# EAGLE design armedbase (EAGLE 6.4)
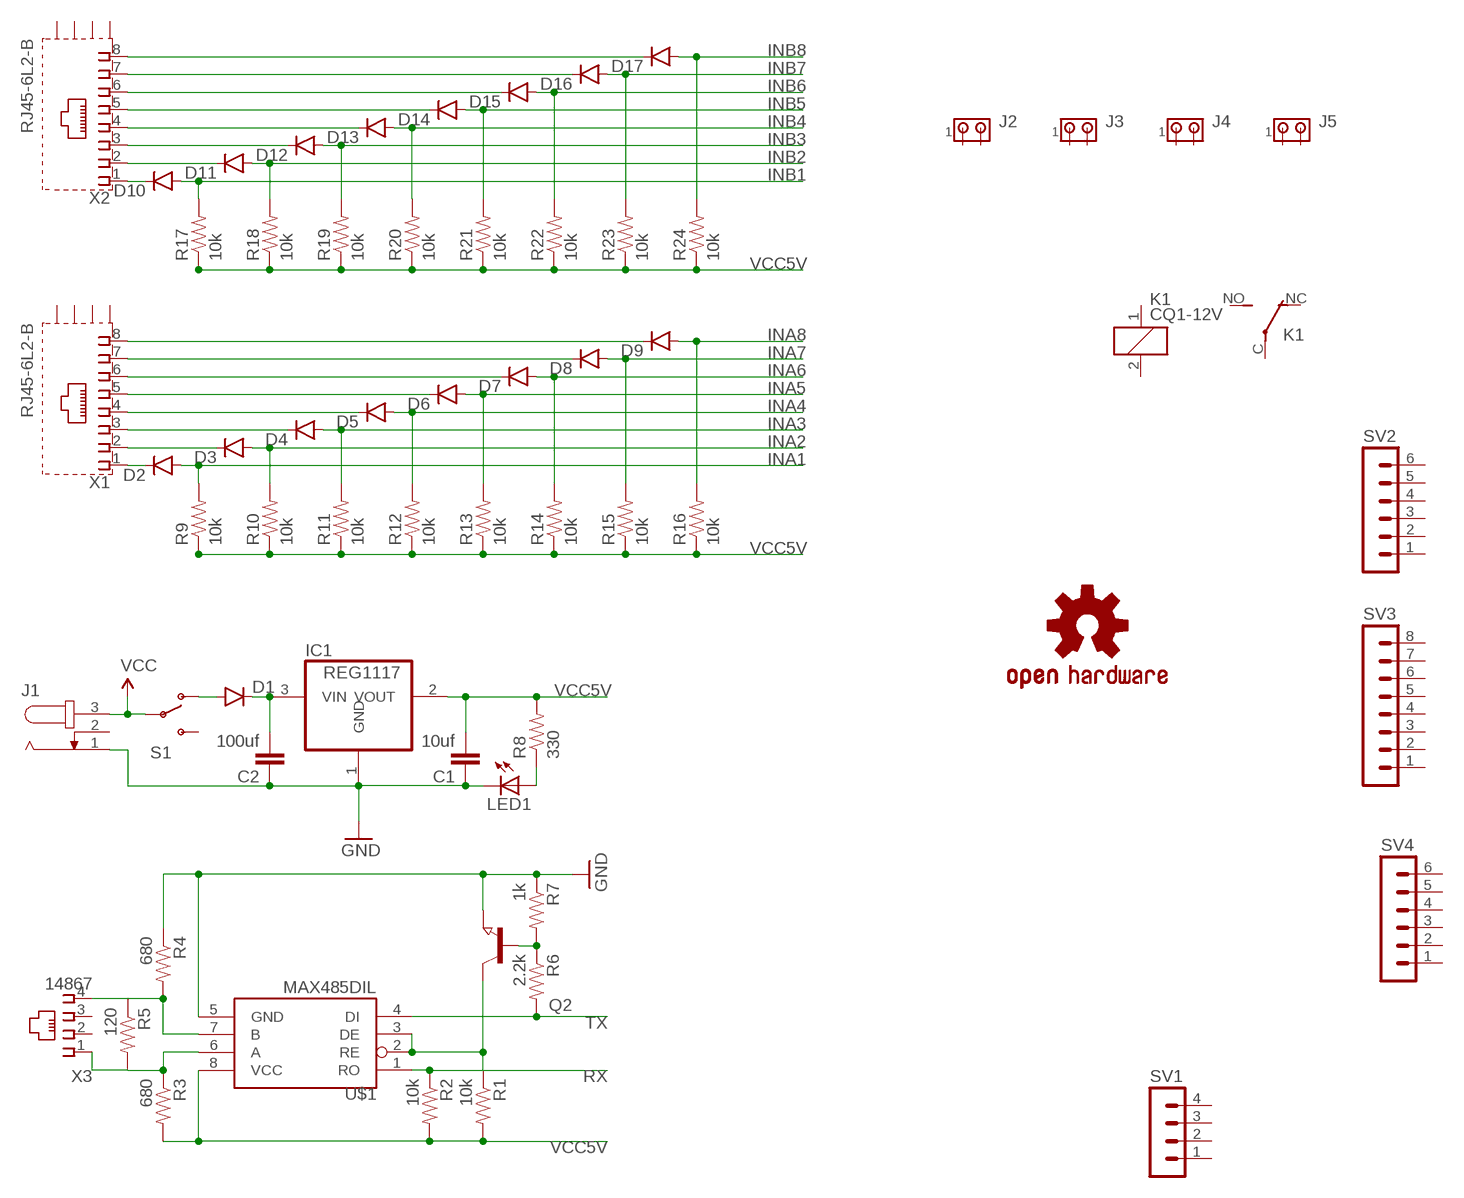
[diagram p0: schematic, sheet 1]

## Parts
C1  10uf  CAP0805  [0805]
C2  100uf  CAP0805  [0805]
D1  DIODESMA  [SMA-DIODE]
D2  DIODESMA  [SMA-DIODE]
D3  DIODESMA  [SMA-DIODE]
D4  DIODESMA  [SMA-DIODE]
D5  DIODESMA  [SMA-DIODE]
D6  DIODESMA  [SMA-DIODE]
D7  DIODESMA  [SMA-DIODE]
D8  DIODESMA  [SMA-DIODE]
D9  DIODESMA  [SMA-DIODE]
D10  DIODESMA  [SMA-DIODE]
D11  DIODESMA  [SMA-DIODE]
D12  DIODESMA  [SMA-DIODE]
D13  DIODESMA  [SMA-DIODE]
D14  DIODESMA  [SMA-DIODE]
D15  DIODESMA  [SMA-DIODE]
D16  DIODESMA  [SMA-DIODE]
D17  DIODESMA  [SMA-DIODE]
IC1  REG1117  [SOT223]
J1  JACK-PLUG1  [SPC4078]
J2  MTA02-156  [1X2MTA]
J3  MTA02-156  [1X2MTA]
J4  MTA02-156  [1X2MTA]
J5  MTA02-156  [1X2MTA]
K1  CQ1-12V  [CQ1]
LED1  LEDCHIP-LED0805  [CHIP-LED0805]
LOGO2  OSHW-LOGOL  [OSHW-LOGO-L]
Q2  NPN-TRANSISTOR_SOT23  [SOT23]
R1  10k  RESISTOR0805-RES  [0805]
R2  10k  RESISTOR0805-RES  [0805]
R3  680  RESISTOR0805-RES  [0805]
R4  680  RESISTOR0805-RES  [0805]
R5  120  RESISTOR0805-RES  [0805]
R6  2.2k  RESISTOR0805-RES  [0805]
R7  1k  RESISTOR0805-RES  [0805]
R8  330  RESISTOR0805-RES  [0805]
R9  10k  RESISTOR0805-RES  [0805]
R10  10k  RESISTOR0805-RES  [0805]
R11  10k  RESISTOR0805-RES  [0805]
R12  10k  RESISTOR0805-RES  [0805]
R13  10k  RESISTOR0805-RES  [0805]
R14  10k  RESISTOR0805-RES  [0805]
R15  10k  RESISTOR0805-RES  [0805]
R16  10k  RESISTOR0805-RES  [0805]
R17  10k  RESISTOR0805-RES  [0805]
R18  10k  RESISTOR0805-RES  [0805]
R19  10k  RESISTOR0805-RES  [0805]
R20  10k  RESISTOR0805-RES  [0805]
R21  10k  RESISTOR0805-RES  [0805]
R22  10k  RESISTOR0805-RES  [0805]
R23  10k  RESISTOR0805-RES  [0805]
R24  10k  RESISTOR0805-RES  [0805]
S1  SWITCH-SPDTSMD2  [SWITCH-SPDT-SMD]
SV1  MA04-1  [MA04-1]
SV2  MA06-1  [MA06-1]
SV3  MA08-1  [MA08-1]
SV4  MA06-1  [MA06-1]
U$1  MAX485DIL  [DIL08]
X1  RJ45-6L2-B  [RJ45-SHIELD2]
X2  RJ45-6L2-B  [RJ45-SHIELD2]
X3  14867  [14867]

## Nets
GND: C1.1 C2.1 IC1.1(GND) J1.1 LED1.C Q2.2(E) R4.1 R7.1 U$1.5(GND)
INA1: D2.A R9.2
INA2: D3.A R10.2
INA3: D4.A R11.2
INA4: D5.A R12.2
INA5: D6.A R13.2
INA6: D7.A R14.2
INA7: D8.A R15.2
INA8: D9.A R16.2
INB1: D10.A R17.2
INB2: D11.A R18.2
INB3: D12.A R19.2
INB4: D13.A R20.2
INB5: D14.A R21.2
INB6: D15.A R22.2
INB7: D16.A R23.2
INB8: D17.A R24.2
N$1: D2.C X1.1
N$2: Q2.3(C) R1.1 U$1.2(RE) U$1.3(DE)
N$3: D10.C X2.1
N$4: Q2.1(B) R6.1 R7.2
N$6: D11.C X2.2
N$7: R4.2 R5.1 U$1.7(B) X3.4
N$8: R3.1 R5.2 U$1.6(A) X3.1
N$9: D12.C X2.3
N$10: D13.C X2.4
N$11: LED1.A R8.1
N$12: D14.C X2.5
N$13: D1.A S1.1(O)
N$14: C2.2 D1.C IC1.3(VIN)
N$15: D15.C X2.6
N$16: D16.C X2.7
N$17: D17.C X2.8
N$25: D3.C X1.2
N$26: D4.C X1.3
N$27: D5.C X1.4
N$28: D6.C X1.5
N$29: D7.C X1.6
N$30: D8.C X1.7
N$31: D9.C X1.8
RX: R2.1 U$1.1(RO)
TX: R6.2 U$1.4(DI)
VCC: J1.3 S1.2(P)
VCC5V: C1.2 IC1.2(VOUT) R1.2 R2.2 R3.2 R8.2 R9.1 R10.1 R11.1 R12.1 R13.1 R14.1 R15.1 R16.1 R17.1 R18.1 R19.1 R20.1 R21.1 R22.1 R23.1 R24.1 U$1.8(VCC)
Unconnected: J1.2 J2.1 J2.2 J3.1 J3.2 J4.1 J4.2 J5.1 J5.2 K1.1 K1.2 K1.C(2:P) K1.NC(2:O) K1.NO(2:S) S1.3(S) SV1.1 SV1.2 SV1.3 SV1.4 SV2.1 SV2.2 SV2.3 SV2.4 SV2.5 SV2.6 SV3.1 SV3.2 SV3.3 SV3.4 SV3.5 SV3.6 SV3.7 SV3.8 SV4.1 SV4.2 SV4.3 SV4.4 SV4.5 SV4.6 X1.S1(S) X1.S2(S) X1.S3(S) X1.S4(S) X2.S1(S) X2.S2(S) X2.S3(S) X2.S4(S) X3.2 X3.3

## Library data of the parts
C1 C2 = SparkFun-Capacitors:CAP: Capacitor Standard 0603 ceramic capacitor, and 0.1" leaded capacitor.
D1-D17 = SparkFun-DiscreteSemi:DIODE: Diode These are standard reverse protection diodes and small signal diodes. SMA package can handle up to about 1A. SOD-323 can handle about 200mA. What the SOD-323 package when ordering, there are some mfgs out there that are 5-pin packages.
IC1 = burr-brown:REG1117: 800mA and 1A Low Dropout (LDO) Positive Regulator 1.8V, 2.5V, 2.85V, 3.3V, 5V, and Adj; MPN: REG1117; OC_FARNELL: 1097566; OC_NEWARK: 14P6981
J1 = con-jack:JACK-PLUG: DC POWER JACK Power Jack, DC, Right Angle, Through Hole, Rated 5A at 16VDC, PC Terminals Distributor: Farnell (www.Farnell.de) Drawing: 84N1161.pdf / 84N1162.pdf Manufacturer: SPC Technology (www.spctechnology.com) Type: SPC4077 / SPC 4078; OC_FARNELL: unknown; OC_NEWARK: unknown
J2-J5 = con-amp:MTA02-156: AMP connector
K1 = relay:CQ1-12V: AUTOMOTIVE QUIET RELAY NAiS Source: http://www.mew-europe.com/.. en_ds_61208_0000.pdf; OC_FARNELL: unknown; OC_NEWARK: unknown
LED1 = led:LED: LED OSRAM: - CHIPLED LG R971, LG N971, LY N971, LG Q971, LY Q971, LO R971, LY R971 LH N974, LH R974 LS Q976, LO Q976, LY Q976 LO Q996 - Hyper CHIPLED LW Q18S LB Q993, LB Q99A, LB R99A - SideLED LS A670, LO A670, LY A670, LG A670, LP A670 LB A673, LV A673, LT A673, LW A673 LH A674 LY A675 LS A676, LA A676, LO A676, LY A676, LW A676 LS A679, LY A679, LG A679 - Hyper Micro SIDELED® LS Y876, LA Y876, LO Y876, LY Y876 LT Y87S - SmartLED LW L88C, LW L88S LB L89C, LB L89S, LG L890 LS L89K, LO L89K, LY L89K LS L896, LA L896, LO L896, LY L896 - TOPLED LS T670, LO T670, LY T670, LG T670, LP T670 LSG T670, LSP T670, LSY T670, LOP T670, LYG T670 LG T671, LOG T671, LSG T671 LB T673, LV T673, LT T673, LW T673 LH T674 LS T676, LA T676, LO T676, LY T676, LB T676, LH T676, LSB T676, LW T676 LB T67C, LV T67C, LT T67C, LS T67K, LO T67K, LY T67K, LW E67C LS E67B, LA E67B, LO E67B, LY E67B, LB E67C, LV E67C, LT E67C LW T67C LS T679, LY T679, LG T679 LS T770, LO T770, LY T770, LG T770, LP T770 LB T773, LV T773, LT T773, LW T773 LH T774 LS E675, LA E675, LY E675, LS T675 LS T776, LA T776, LO T776, LY T776, LB T776 LHGB T686 LT T68C, LB T68C - Hyper Mini TOPLED® LB M676 - Mini TOPLED Santana® LG M470 LS M47K, LO M47K, LY M47K Source: http://www.osram.convergy.de LUXEON: - LUMILED® LXK2-PW12-R00, LXK2-PW12-S00, LXK2-PW14-U00, LXK2-PW14-V00 LXK2-PM12-R00, LXK2-PM12-S00, LXK2-PM14-U00 LXK2-PE12-Q00, LXK2-PE12-R00, LXK2-PE12-S00, LXK2-PE14-T00, LXK2-PE14-U00 LXK2-PB12-K00, LXK2-PB12-L00, LXK2-PB12-M00, LXK2-PB14-N00, LXK2-PB14-P00, LXK2-PB14-Q00 LXK2-PR12-L00, LXK2-PR12-M00, LXK2-PR14-Q00, LXK2-PR14-R00 LXK2-PD12-Q00, LXK2-PD12-R00, LXK2-PD12-S00 LXK2-PH12-R00, LXK2-PH12-S00 LXK2-PL12-P00, LXK2-PL12-Q00, LXK2-PL12-R00 Source: www.luxeon.com KINGBRIGHT: KA-3528ASYC Source: www.kingbright.com
LOGO2 = SparkFun-Aesthetics:OSHW-LOGO: Open Source Hardware Logo This logo indicates the piece of hardware it is found on incorporates a OSHW license and/or adheres to the definition of open source hardware found here: http://freedomdefined.org/OSHW
Q2 = semicon-smd-ipc:NPN-TRANSISTOR_: NPN TRANSISTOR
R1-R24 = SparkFun-Passives:RESISTOR: Resistor Basic schematic elements and footprints for 0603, 1206, and PTH resistors.
S1 = SparkFun-Electromechanical:SWITCH-SPDT: SPDT Switch Simple slide switch, Spark Fun Electronics SKU : COM-00102 DPDT SMT slide switch, AYZ0202, SWCH-08179
SV1 = con-lstb:MA04-1: PIN HEADER; OC_FARNELL: unknown; OC_NEWARK: unknown
SV2 SV4 = con-lstb:MA06-1: PIN HEADER; OC_FARNELL: unknown; OC_NEWARK: unknown
SV3 = con-lstb:MA08-1: PIN HEADER; OC_FARNELL: unknown; OC_NEWARK: unknown
U$1 = SparkFun-DigitalIC:MAX485: RS-485 transceiver
X1 X2 = con-tycoelectronics:RJ45*2: RJ45 Low Profile Shield Type 2 For all RJ45 L, LC, LCT and X Series Models Source: www.tycoelectronics.com .. ENG_DS_1654001_1099_RJ_L_0507.pdf; MPN: RJ45-6L2-B; OC_FARNELL: unknown; OC_NEWARK: 16R6096
X3 = con-4ucon:14867: RJ11 Connector Source: 4UCON TECHNOLOGY INC. 14867.pdf; OC_FARNELL: unknown; OC_NEWARK: unknown

## Board
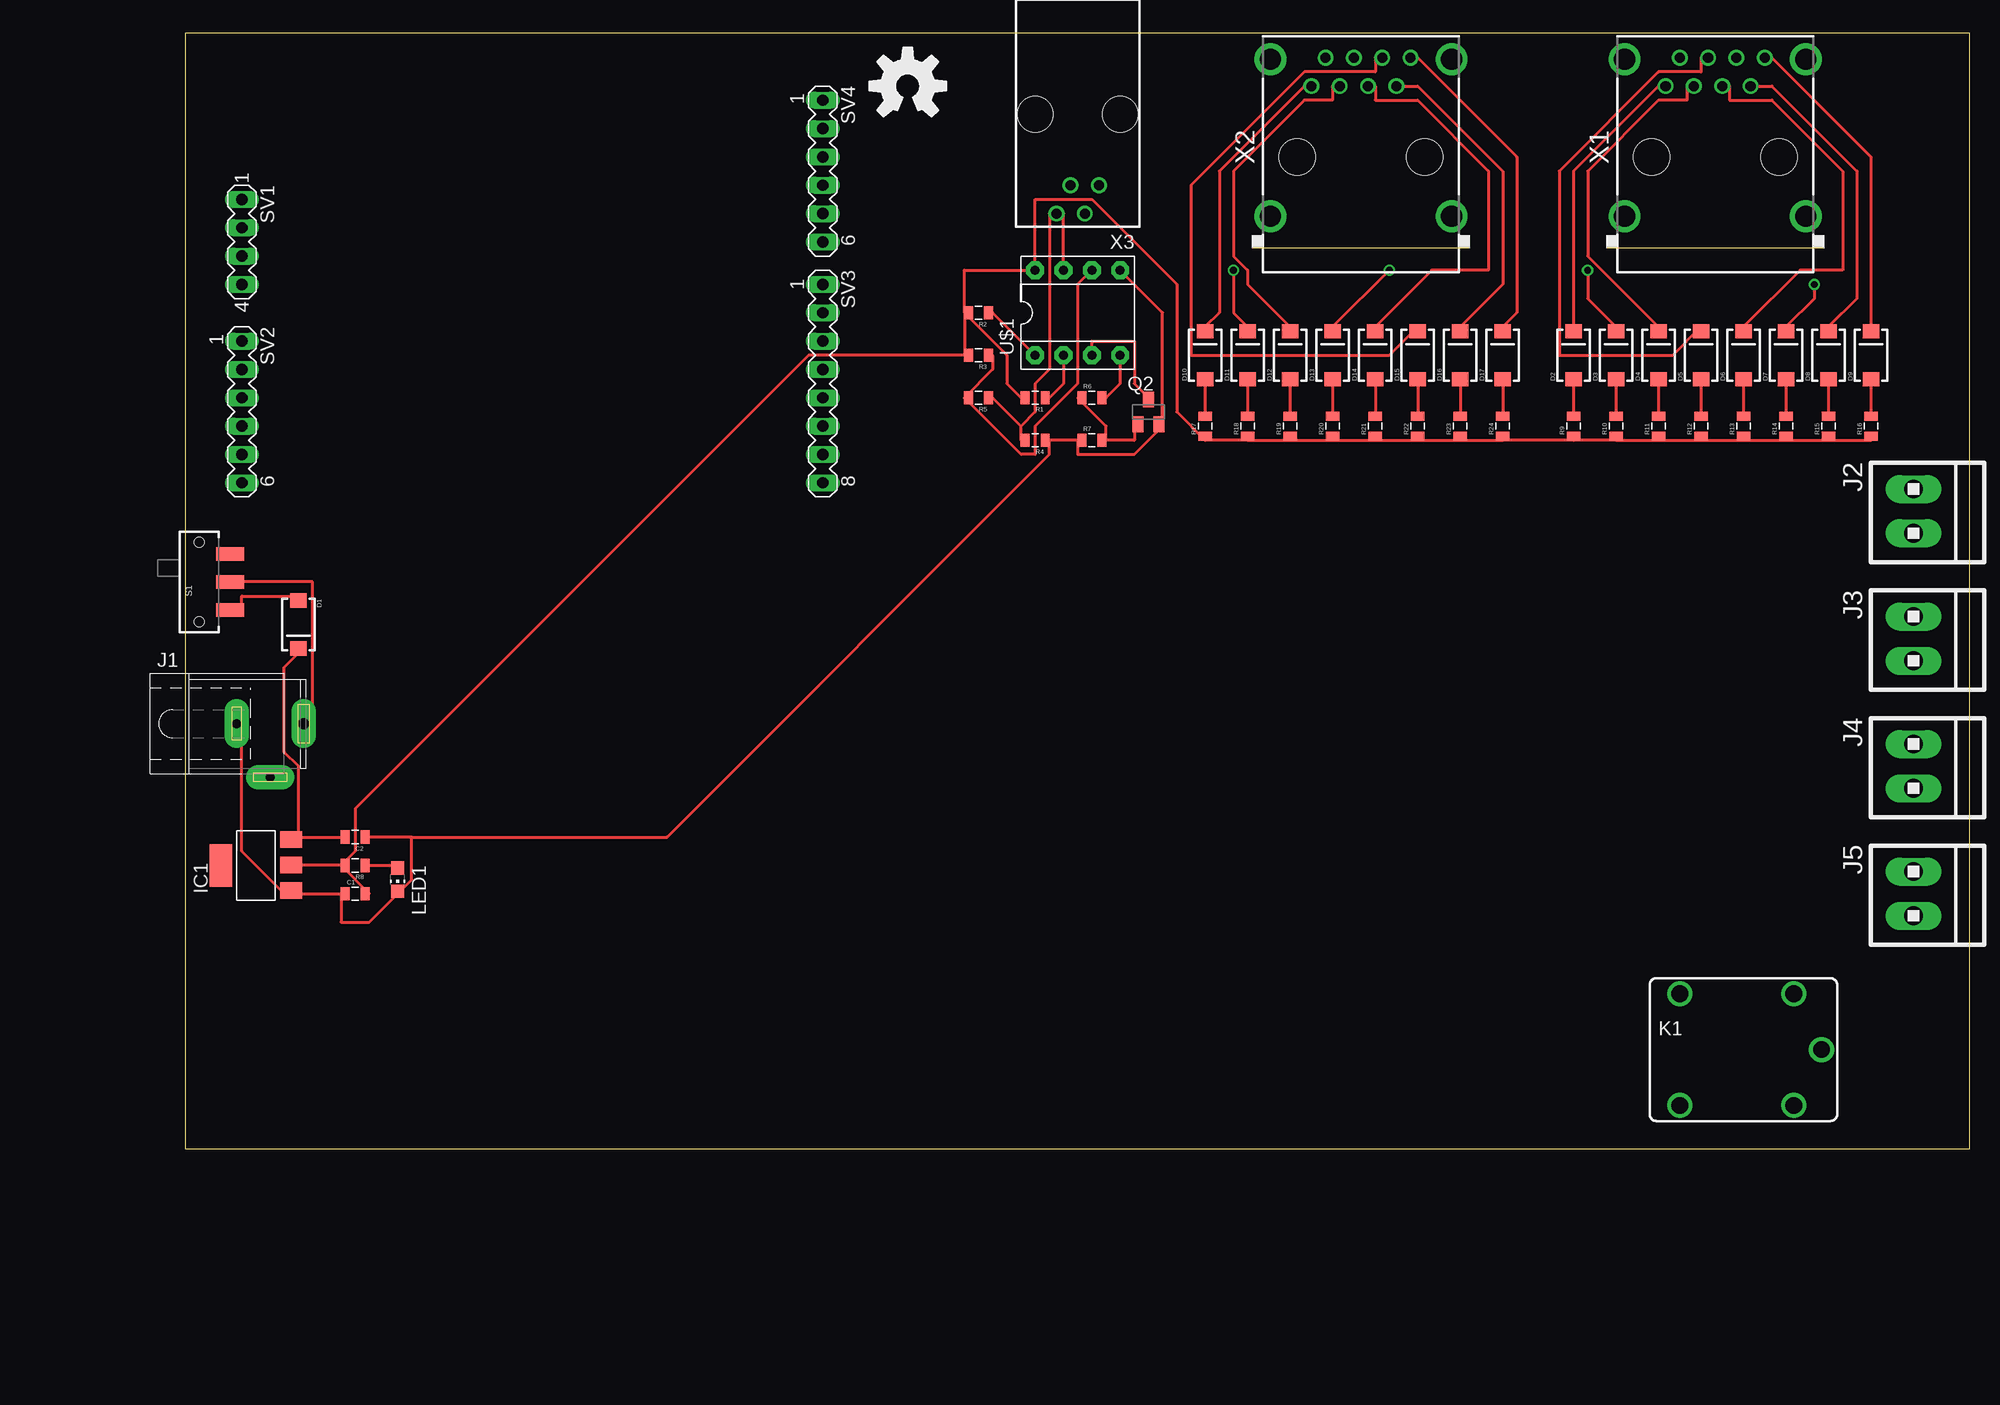
[diagram p1: board, top side]
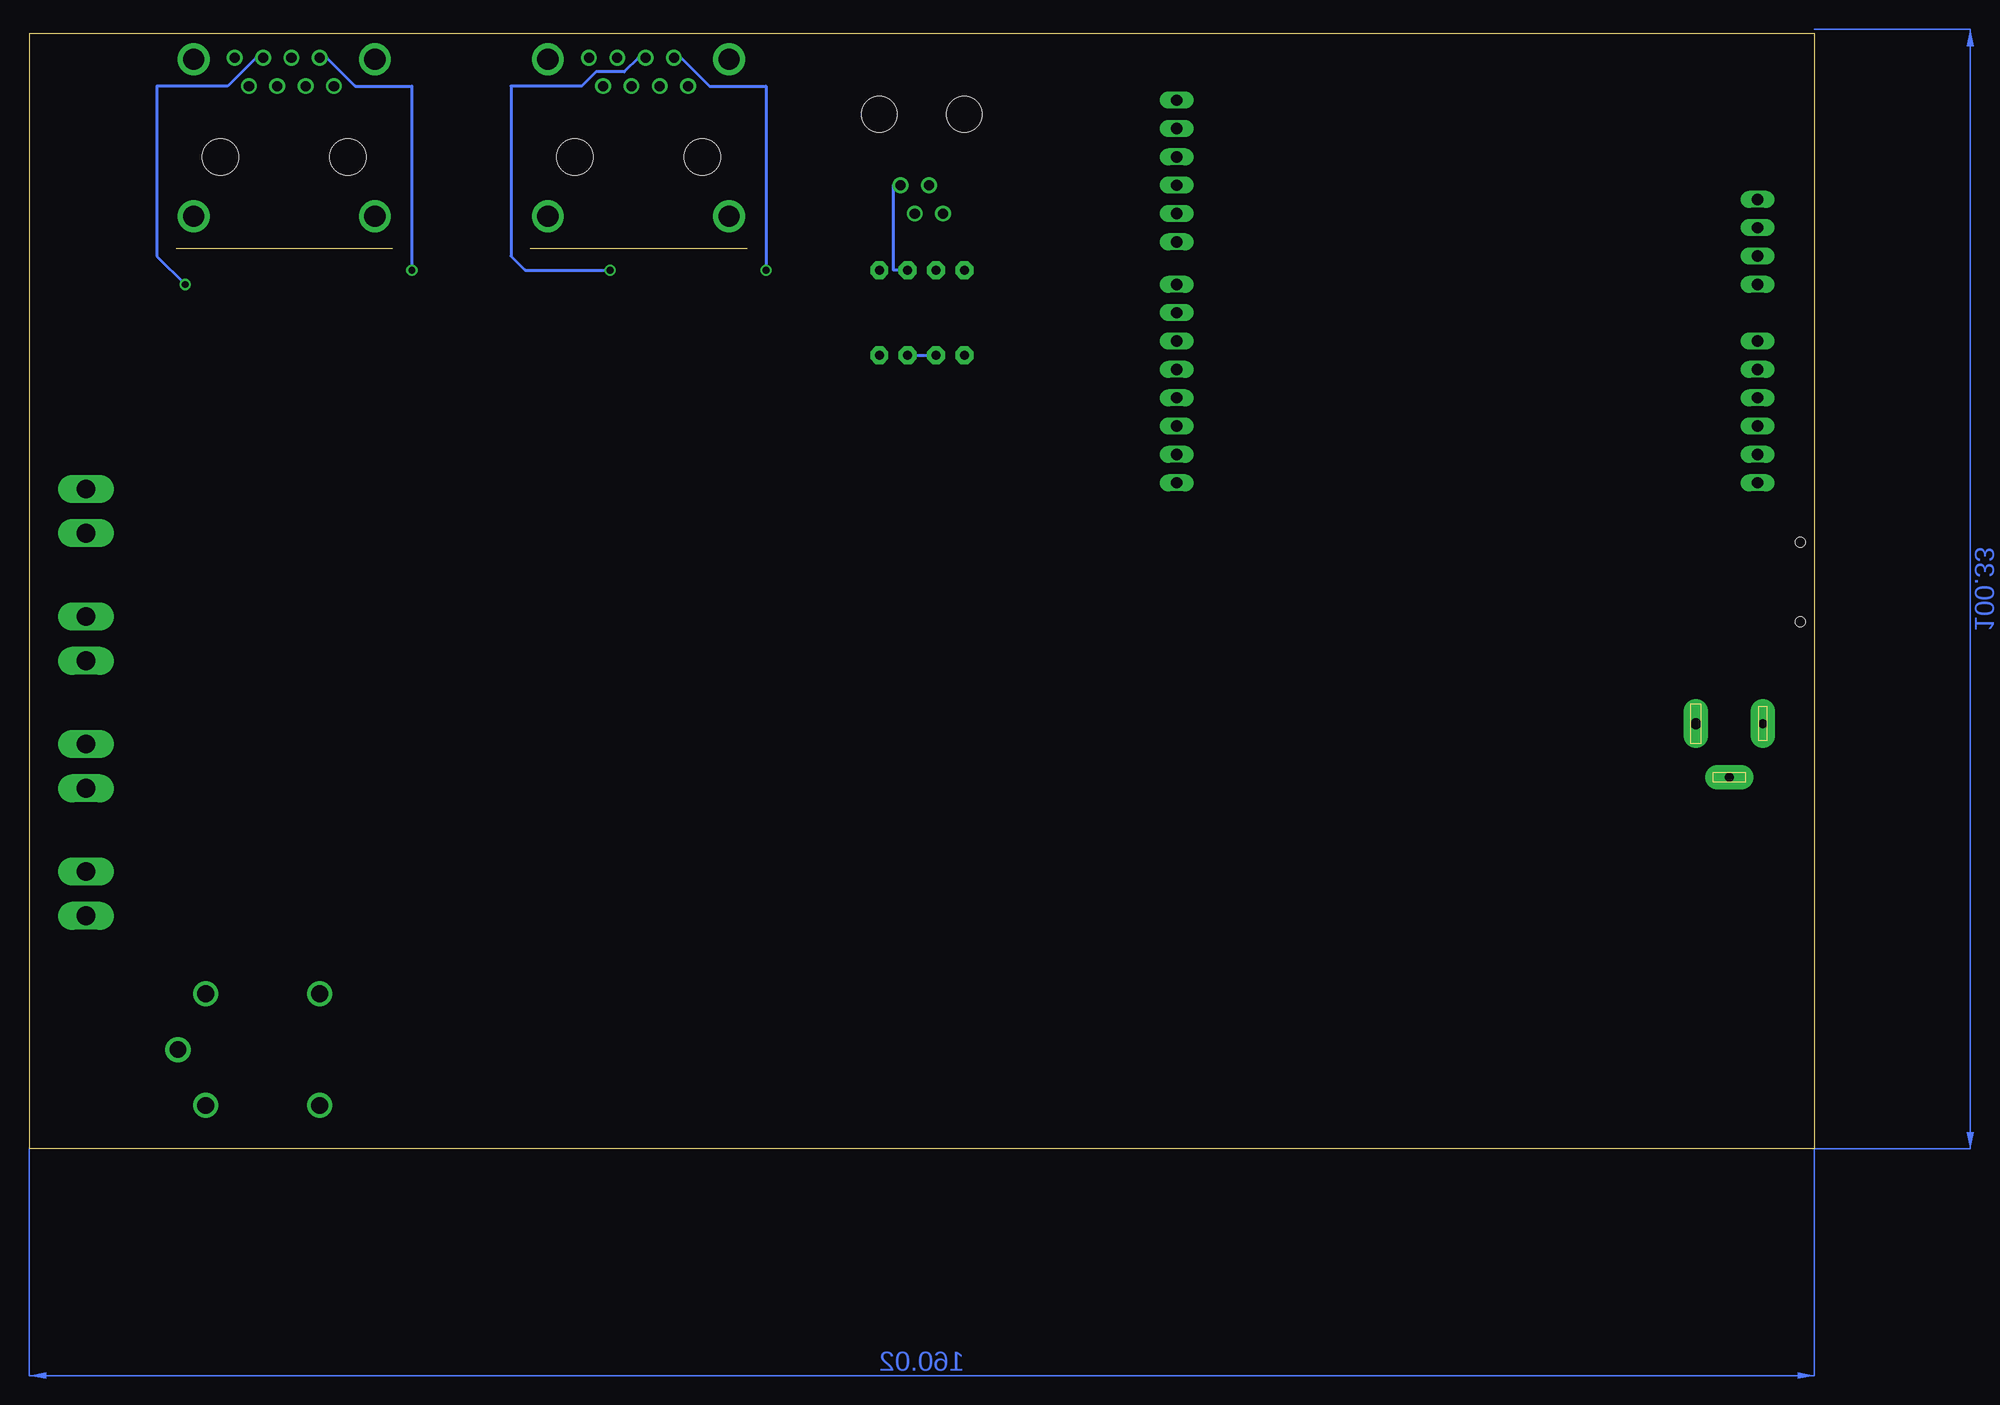
[diagram p2: board, bottom side, seen from below]

Size 160 x 100 mm. Coordinates in mm from the lower left corner, seen from the top.
Outline: 0,0 160,0 160,100 0,100 0,0
Copper layers (1*16): Top 0.035mm / dielectric 1.5mm / Bottom 0.035mm
Design rules "default": minimum track width 10mil, minimum drill 24mil, track to track 8mil, track to pad 8mil, pad to pad 8mil, via to via 8mil, smd to smd 8mil, copper to edge 40mil, drill to drill 8mil, minimum pad ring 10mil, minimum via ring 8mil, stop-mask expansion 4mil, vias tented up to drill 0mil, thermal gap 10mil

### Footprints (pad centres in the part's own frame; a part is rotated, then mirrored left to right if it is on the bottom)
0805 = smd 0.8 x 1.2: 1 -0.9,0; 2 0.9,0
SMA-DIODE = smd 1.27 x 1.47: A -2.15,0; C 2.15,0
SOT223 = smd 1.499 x 2.007: 1 -2.261,-3.15; 2 0.025,-3.15; 3 2.311,-3.15 | smd 3.81 x 2.007: 4 0,3.15
SPC4078 = drill 0.8 pad 2.184 long: 1 -3,0; 2 0,-4.8 | drill 1 pad 2.184 long: 3 3,0
1X2MTA = drill 1.676 long: 1 1.981,0; 2 -1.981,0
CQ1 = drill 1.5: 1 4.5,-5; 2 4.5,5; C 7,0; NC -5.7,-5; NO -5.7,5
CHIP-LED0805 = smd 1.2 x 1.2: A 0,-1.05; C 0,1.05
SOT23 = smd 1 x 1.4: 1 -0.95,-1.1; 2 0.95,-1.1; 3 0,1.1
SWITCH-SPDT-SMD = smd 1.2 x 2.5: 1 -2.5,-2.75; 2 0,-2.75; 3 2.5,-2.75 | hole 0.9: -3.55,0; 3.55,0
MA04-1 = drill 1.016 long: 1 -3.81,0; 2 -1.27,0; 3 1.27,0; 4 3.81,0
MA06-1 = drill 1.016 long: 1 -6.35,0; 2 -3.81,0; 3 -1.27,0; 4 1.27,0; 5 3.81,0; 6 6.35,0
MA08-1 = drill 1.016 long: 1 -8.89,0; 2 -6.35,0; 3 -3.81,0; 4 -1.27,0; 5 1.27,0; 6 3.81,0; 7 6.35,0; 8 8.89,0
DIL08 = drill 0.813 pad 1.6 octagon: 1 -3.81,-3.81; 2 -1.27,-3.81; 3 1.27,-3.81; 4 3.81,-3.81; 5 3.81,3.81; 6 1.27,3.81; 7 -1.27,3.81; 8 -3.81,3.81
RJ45-SHIELD2 = drill 0.9 pad 1.4: 1 -4.445,6.35; 2 -3.175,8.89; 3 -1.905,6.35; 4 -0.635,8.89; 5 0.635,6.35; 6 1.905,8.89; 7 3.175,6.35; 8 4.445,8.89 | drill 1.9 pad 2.5: S1 -8.128,-5.33; S2 8.128,-5.33; S3 -8.128,8.76; S4 8.128,8.76 | hole 3.251: -5.715,0; 5.715,0
14867 = drill 0.9 pad 1.422: 1 -1.905,6.35; 2 -0.635,8.89; 3 0.635,6.35; 4 1.905,8.89 | hole 3.2: -3.81,0; 3.81,0

### Placement (x,y rotation side)
C1  15.24,22.86 0 top
C2  15.24,27.94 180 top
D1  10.16,46.99 270 top
D2  124.46,71.12 90 top
D3  128.27,71.12 90 top
D4  132.08,71.12 90 top
D5  135.89,71.12 90 top
D6  139.7,71.12 90 top
D7  143.51,71.12 90 top
D8  147.32,71.12 90 top
D9  151.13,71.12 90 top
D10  91.44,71.12 90 top
D11  95.25,71.12 90 top
D12  99.06,71.12 90 top
D13  102.87,71.12 90 top
D14  106.68,71.12 90 top
D15  110.49,71.12 90 top
D16  114.3,71.12 90 top
D17  118.11,71.12 90 top
IC1  6.35,25.4 90 top
J1  7.62,38.1 0 top
J2  154.94,57.15 270 top
J3  154.94,45.72 270 top
J4  154.94,34.29 270 top
J5  154.94,22.86 270 top
K1  139.7,8.89 0 top
LED1  19.05,24.13 180 top
LOGO2  64.77,95.25 0 top
Q2  86.36,66.04 0 top
R1  76.2,67.31 180 top
R2  71.12,74.93 180 top
R3  71.12,71.12 180 top
R4  76.2,63.5 180 top
R5  71.12,67.31 180 top
R6  81.28,67.31 0 top
R7  81.28,63.5 0 top
R8  15.24,25.4 180 top
R9  124.46,64.77 90 top
R10  128.27,64.77 90 top
R11  132.08,64.77 90 top
R12  135.89,64.77 90 top
R13  139.7,64.77 90 top
R14  143.51,64.77 90 top
R15  147.32,64.77 90 top
R16  151.13,64.77 90 top
R17  91.44,64.77 90 top
R18  95.25,64.77 90 top
R19  99.06,64.77 90 top
R20  102.87,64.77 90 top
R21  106.68,64.77 90 top
R22  110.49,64.77 90 top
R23  114.3,64.77 90 top
R24  118.11,64.77 90 top
S1  1.27,50.8 90 top
SV1  5.08,81.28 270 top
SV2  5.08,66.04 270 top
SV3  57.15,68.58 270 top
SV4  57.15,87.63 270 top
U$1  80.01,74.93 0 top
X1  137.16,88.9 0 top
X2  105.41,88.9 0 top
X3  80.01,92.71 180 top

### Tracks (layer width: path | path; a pad name or v marks a point on that pad's centre or on a via)
GND
  Top 0.254: 80.01,63.5 77.47,63.5 | 87.63,64.77 85.09,62.23 80.01,62.23 80.01,63.5 | 80.01,63.5 R7.1 | U$1.5 87.63,74.93 87.63,64.77 | 87.63,64.77 Q2.2 | 13.97,22.86 10.16,22.86 IC1.1 8.89,22.86 5.08,26.67 5.08,38.1 J1.1 | 19.05,22.86 16.51,20.32 13.97,20.32 13.97,22.86 | 13.97,22.86 C1.1 | 20.32,27.94 C2.1 | 20.32,27.94 20.32,24.13 19.05,22.86 | 19.05,22.86 LED1.C | 77.47,63.5 77.47,62.23 43.18,27.94 20.32,27.94 | 77.47,63.5 R4.1
INA1
  Top 0.254: D2.A R9.2
INA2
  Top 0.254: D3.A R10.2
INA3
  Top 0.254: D4.A R11.2
INA4
  Top 0.254: D5.A R12.2
INA5
  Top 0.254: D6.A R13.2
INA6
  Top 0.254: D7.A R14.2
INA7
  Top 0.254: D8.A R15.2
INA8
  Top 0.254: D9.A R16.2
INB1
  Top 0.254: D10.A R17.2
INB2
  Top 0.254: D11.A R18.2
INB3
  Top 0.254: D12.A R19.2
INB4
  Top 0.254: D13.A R20.2
INB5
  Top 0.254: D14.A R21.2
INB6
  Top 0.254: D15.A R22.2
INB7
  Top 0.254: D16.A R23.2
INB8
  Top 0.254: D17.A R24.2
N$1
  Top 0.254: D2.C 124.46,87.63 132.08,95.25 X1.1
N$2
  Top 0.254: U$1.2 78.74,68.58 77.47,67.31 R1.1 | U$1.3 81.28,72.39 85.09,72.39 85.09,68.58 86.36,67.31 Q2.3
  Bottom 0.254: U$1.3 U$1.2
N$3
  Top 0.254: D10.C 91.44,73.66 92.71,74.93 92.71,87.63 100.33,95.25 X2.1
N$4
  Top 0.254: 82.55,63.5 85.09,63.5 85.09,64.77 Q2.1 | 82.55,63.5 82.55,64.77 80.01,67.31 R6.1 | 82.55,63.5 R7.2
N$6  (via drill 0.61)
  Top 0.254: v93.98,78.74 93.98,74.93 95.25,73.66 D11.C
  Bottom 0.254: v93.98,78.74 93.98,95.25 99.06,95.25 101.6,97.79 X2.2
N$7
  Top 0.254: 74.93,64.77 72.39,67.31 R5.1 | 74.93,64.77 74.93,63.5 R4.2 | U$1.7 78.74,83.82 X3.4 77.47,83.82 77.47,69.85 76.2,68.58 76.2,66.04 74.93,64.77
N$8
  Top 0.254: 69.85,67.31 72.39,69.85 72.39,71.12 R3.1 | 69.85,67.31 74.93,62.23 76.2,62.23 76.2,64.77 80.01,68.58 80.01,77.47 U$1.6 | 69.85,67.31 R5.2
  Bottom 0.254: U$1.6 82.55,78.74 82.55,86.36 X3.1
N$9
  Top 0.254: D12.C 99.06,73.66 95.25,77.47 95.25,78.74 93.98,80.01 93.98,87.63 100.33,93.98 102.87,93.98 102.87,95.25 X2.3
N$10  (via drill 0.61)
  Top 0.254: v107.95,78.74 102.87,73.66 D13.C
  Bottom 0.254: v107.95,78.74 115.57,78.74 116.84,80.01 116.84,95.25 110.49,95.25 109.22,96.52 106.68,96.52 105.41,97.79 X2.4
N$11
  Top 0.254: R8.1 19.05,25.4 LED1.A
N$12
  Top 0.254: D14.C 106.68,73.66 111.76,78.74 116.84,78.74 116.84,87.63 110.49,93.98 106.68,93.98 106.68,95.25 X2.5
N$13
  Top 0.254: D1.A 10.16,49.53 5.08,49.53 5.08,48.26 S1.1
N$14
  Top 0.254: 10.16,27.94 C2.2 | 10.16,27.94 10.16,34.29 8.89,35.56 8.89,43.18 10.16,44.45 D1.C | 10.16,27.94 IC1.3
N$15
  Top 0.254: D15.C 110.49,73.66 107.95,71.12 90.17,71.12 90.17,86.36 100.33,96.52 106.68,96.52 106.68,97.79 X2.6
N$16
  Top 0.254: X2.7 110.49,95.25 118.11,87.63 118.11,77.47 114.3,73.66 D16.C
N$17
  Top 0.254: D17.C 118.11,73.66 119.38,74.93 119.38,88.9 110.49,97.79 X2.8
N$25  (via drill 0.61)
  Top 0.254: v125.73,78.74 125.73,76.2 128.27,73.66 D3.C
  Bottom 0.254: v125.73,78.74 125.73,95.25 130.81,95.25 133.35,97.79 X1.2
N$26
  Top 0.254: D4.C 132.08,73.66 125.73,80.01 125.73,87.63 132.08,93.98 134.62,93.98 134.62,95.25 X1.3
N$27
  Top 0.254: D5.C 135.89,73.66 133.35,71.12 123.19,71.12 123.19,87.63 132.08,96.52 135.89,96.52 135.89,97.79 X1.4
N$28
  Top 0.254: D6.C 139.7,73.66 144.78,78.74 148.59,78.74 148.59,87.63 142.24,93.98 138.43,93.98 138.43,95.25 X1.5
N$29  (via drill 0.61)
  Top 0.254: v146.05,77.47 146.05,76.2 143.51,73.66 D7.C
  Bottom 0.254: v146.05,77.47 148.59,80.01 148.59,95.25 142.24,95.25 139.7,97.79 X1.6
N$30
  Top 0.254: X1.7 142.24,95.25 149.86,87.63 149.86,76.2 147.32,73.66 D8.C
N$31
  Top 0.254: D9.C 151.13,88.9 142.24,97.79 X1.8
RX
  Top 0.254: U$1.1 72.39,74.93 R2.1
TX
  Top 0.254: U$1.4 83.82,68.58 82.55,67.31 R6.2
VCC
  Top 0.254: S1.2 11.43,50.8 11.43,38.1 J1.3
VCC5V
  Top 0.254: 95.25,63.5 91.44,63.5 | 95.25,63.5 99.06,63.5 | 95.25,63.5 R18.1 | 99.06,63.5 102.87,63.5 | 99.06,63.5 R19.1 | 102.87,63.5 106.68,63.5 | 102.87,63.5 R20.1 | 106.68,63.5 110.49,63.5 | 106.68,63.5 R21.1 | 110.49,63.5 114.3,63.5 | 110.49,63.5 R22.1 | 114.3,63.5 118.11,63.5 | 114.3,63.5 R23.1 | 128.27,63.5 124.46,63.5 | 128.27,63.5 132.08,63.5 | 128.27,63.5 R10.1 | 132.08,63.5 135.89,63.5 | 132.08,63.5 R11.1 | 135.89,63.5 139.7,63.5 | 135.89,63.5 R12.1 | 139.7,63.5 143.51,63.5 | 139.7,63.5 R13.1 | 143.51,63.5 147.32,63.5 | 143.51,63.5 R14.1 | 147.32,63.5 151.13,63.5 R16.1 | 147.32,63.5 R15.1 | 124.46,63.5 118.11,63.5 | 118.11,63.5 R24.1 | 124.46,63.5 R9.1 | 13.97,25.4 16.51,22.86 C1.2 | 13.97,25.4 10.16,25.4 IC1.2 | 69.85,74.93 69.85,71.12 | 69.85,74.93 73.66,71.12 73.66,68.58 74.93,67.31 R1.2 | 69.85,74.93 69.85,78.74 U$1.8 76.2,85.09 81.28,85.09 88.9,77.47 88.9,66.04 91.44,63.5 | 69.85,74.93 R2.2 | 13.97,25.4 15.24,26.67 15.24,30.48 55.88,71.12 69.85,71.12 | 13.97,25.4 R8.2 | 69.85,71.12 R3.2 | 91.44,63.5 R17.1
(copper drawn outside any net)
  shapes: Bottom area x2